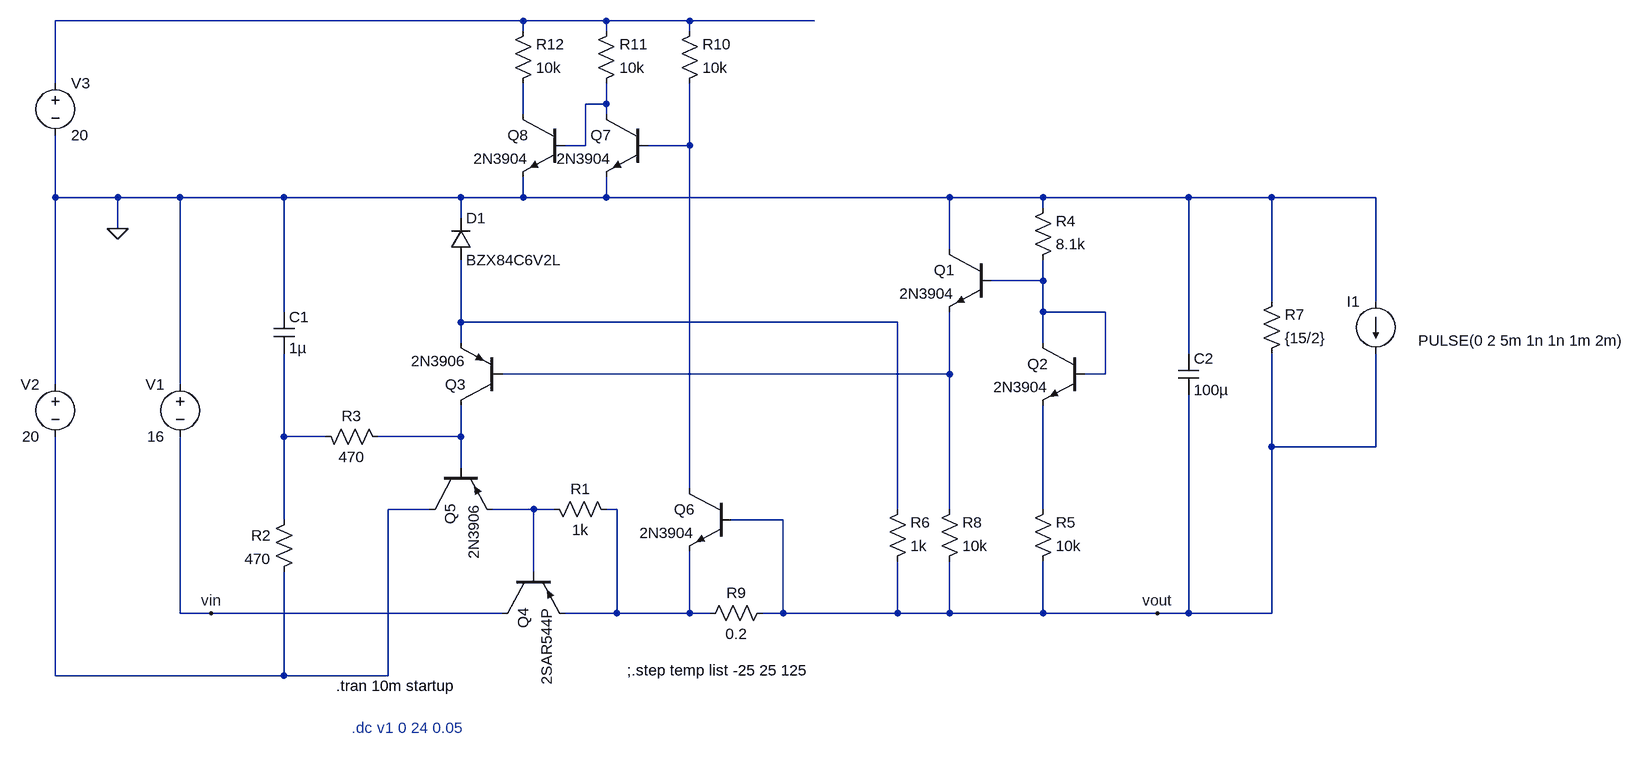
[diagram p0: schematic linear_regulator_negative1.asc]
linear_regulator_negative1.asc, the LTspice schematic file:
Version 4.1
SHEET 1 2004 928
WIRE 304 -176 -416 -176
WIRE 432 -176 304 -176
WIRE 560 -176 432 -176
WIRE 752 -176 560 -176
WIRE 304 -160 304 -176
WIRE 432 -160 432 -176
WIRE 560 -160 560 -176
WIRE -416 -80 -416 -176
WIRE 432 -48 432 -80
WIRE 432 -48 400 -48
WIRE 304 -32 304 -80
WIRE 432 -32 432 -48
WIRE 400 16 400 -48
WIRE 400 16 368 16
WIRE 560 16 560 -80
WIRE 560 16 496 16
WIRE -416 96 -416 0
WIRE -320 96 -416 96
WIRE -224 96 -320 96
WIRE -64 96 -224 96
WIRE 208 96 -64 96
WIRE 304 96 304 64
WIRE 304 96 208 96
WIRE 432 96 432 64
WIRE 432 96 304 96
WIRE 960 96 432 96
WIRE 1104 96 960 96
WIRE 1328 96 1104 96
WIRE 1456 96 1328 96
WIRE 1616 96 1456 96
WIRE 1104 112 1104 96
WIRE 208 128 208 96
WIRE -320 144 -320 96
WIRE 960 176 960 96
WIRE 1104 224 1104 192
WIRE 1104 224 1024 224
WIRE 1456 256 1456 96
WIRE 1616 256 1616 96
WIRE -64 272 -64 96
WIRE 1104 272 1104 224
WIRE 1200 272 1104 272
WIRE 208 288 208 192
WIRE 880 288 208 288
WIRE 208 320 208 288
WIRE 1104 320 1104 272
WIRE 1328 336 1328 96
WIRE 960 368 960 272
WIRE 960 368 272 368
WIRE 1200 368 1200 272
WIRE 1200 368 1168 368
WIRE -416 384 -416 96
WIRE -224 384 -224 96
WIRE -64 464 -64 336
WIRE 0 464 -64 464
WIRE 208 464 208 416
WIRE 208 464 80 464
WIRE 1456 480 1456 336
WIRE 1616 480 1616 336
WIRE 1616 480 1456 480
WIRE 208 512 208 464
WIRE 560 544 560 16
WIRE 160 576 96 576
WIRE 320 576 256 576
WIRE 352 576 320 576
WIRE 448 576 432 576
WIRE 880 576 880 288
WIRE 960 576 960 368
WIRE 1104 576 1104 416
WIRE -64 592 -64 464
WIRE 704 592 624 592
WIRE 320 672 320 576
WIRE -224 736 -224 464
WIRE -176 736 -224 736
WIRE 272 736 -176 736
WIRE 448 736 448 576
WIRE 448 736 368 736
WIRE 560 736 560 640
WIRE 560 736 448 736
WIRE 592 736 560 736
WIRE 704 736 704 592
WIRE 704 736 672 736
WIRE 880 736 880 656
WIRE 880 736 704 736
WIRE 960 736 960 656
WIRE 960 736 880 736
WIRE 1104 736 1104 656
WIRE 1104 736 960 736
WIRE 1280 736 1104 736
WIRE 1328 736 1328 400
WIRE 1328 736 1280 736
WIRE 1456 736 1456 480
WIRE 1456 736 1328 736
WIRE -416 832 -416 464
WIRE -64 832 -64 672
WIRE -64 832 -416 832
WIRE 96 832 96 576
WIRE 96 832 -64 832
FLAG -320 144 0
FLAG -176 736 vin
FLAG 1280 736 vout
SYMBOL npn 1024 176 M0
SYMATTR InstName Q1
SYMATTR Value 2N3904
SYMBOL npn 1168 320 M0
SYMATTR InstName Q2
SYMATTR Value 2N3904
SYMBOL res 448 592 M270
WINDOW 0 32 56 VTop 2
WINDOW 3 0 56 VBottom 2
SYMATTR InstName R1
SYMATTR Value 1k
SYMBOL res -48 576 M0
SYMATTR InstName R2
SYMATTR Value 470
SYMBOL res -16 448 M90
WINDOW 0 0 56 VBottom 2
WINDOW 3 32 56 VTop 2
SYMATTR InstName R3
SYMATTR Value 470
SYMBOL res 1088 208 M180
WINDOW 0 36 76 Left 2
WINDOW 3 36 40 Left 2
SYMATTR InstName R4
SYMATTR Value 8.1k
SYMBOL res 1088 672 M180
WINDOW 0 36 76 Left 2
WINDOW 3 36 40 Left 2
SYMATTR InstName R5
SYMATTR Value 10k
SYMBOL res 864 672 M180
WINDOW 0 36 76 Left 2
WINDOW 3 36 40 Left 2
SYMATTR InstName R6
SYMATTR Value 1k
SYMBOL diode 192 192 M180
WINDOW 0 24 64 Left 2
WINDOW 3 24 0 Left 2
SYMATTR InstName D1
SYMATTR Value BZX84C6V2L
SYMBOL cap -80 336 M180
WINDOW 0 24 56 Left 2
WINDOW 3 24 8 Left 2
SYMATTR InstName C1
SYMATTR Value 1µ
SYMBOL cap 1312 400 M180
WINDOW 0 24 56 Left 2
WINDOW 3 24 8 Left 2
SYMATTR InstName C2
SYMATTR Value 100µ
SYMBOL voltage -224 368 M0
SYMATTR InstName V1
SYMATTR Value 16
SYMBOL res 1440 352 M180
WINDOW 0 36 76 Left 2
WINDOW 3 36 40 Left 2
SYMATTR InstName R7
SYMATTR Value {15/2}
SYMBOL pnp 272 672 M90
SYMATTR InstName Q4
SYMATTR Value 2SAR544P
SYMBOL res 944 672 M180
WINDOW 0 36 76 Left 2
WINDOW 3 36 40 Left 2
SYMATTR InstName R8
SYMATTR Value 10k
SYMBOL pnp 160 512 M90
SYMATTR InstName Q5
SYMATTR Value 2N3906
SYMBOL current 1616 256 M0
WINDOW 123 0 0 Left 0
WINDOW 39 0 0 Left 0
WINDOW 3 -383 60 Left 2
SYMATTR InstName I1
SYMATTR Value PULSE(0 2 5m 1n 1n 1m 2m)
SYMBOL voltage -416 368 M0
WINDOW 123 0 0 Left 0
WINDOW 39 0 0 Left 0
SYMATTR InstName V2
SYMATTR Value 20
SYMBOL pnp 272 416 R180
SYMATTR InstName Q3
SYMATTR Value 2N3906
SYMBOL res 688 720 R90
WINDOW 0 0 56 VBottom 2
WINDOW 3 32 56 VTop 2
SYMATTR InstName R9
SYMATTR Value 0.2
SYMBOL npn 624 544 M0
SYMATTR InstName Q6
SYMATTR Value 2N3904
SYMBOL res 544 -64 M180
WINDOW 0 36 76 Left 2
WINDOW 3 36 40 Left 2
SYMATTR InstName R10
SYMATTR Value 10k
SYMBOL voltage -416 -96 R0
WINDOW 123 0 0 Left 0
WINDOW 39 0 0 Left 0
SYMATTR InstName V3
SYMATTR Value 20
SYMBOL res 416 -64 M180
WINDOW 0 36 76 Left 2
WINDOW 3 36 40 Left 2
SYMATTR InstName R11
SYMATTR Value 10k
SYMBOL npn 496 -32 M0
SYMATTR InstName Q7
SYMATTR Value 2N3904
SYMBOL res 288 -64 M180
WINDOW 0 36 76 Left 2
WINDOW 3 36 40 Left 2
SYMATTR InstName R12
SYMATTR Value 10k
SYMBOL npn 368 -32 M0
SYMATTR InstName Q8
SYMATTR Value 2N3904
TEXT 16 848 Left 2 !.tran 10m startup
TEXT 464 824 Left 2 !;.step temp list -25 25 125
TEXT 40 912 Left 2 ;.dc v1 0 24 0.05

The netlist it stands for:
* linear_regulator_negative1.asc
Q1 0 N005 N007 0 2N3904
Q2 N005 N005 N013 0 2N3904
R1 N012 N011 1k
R2 N008 N010 470
R3 N008 N009 470
R4 N005 0 8.1k
R5 vout N013 10k
R6 vout N006 1k
D1 N006 0 BZX84C6V2L
C1 N008 0 1µ
C2 vout 0 100µ
V1 0 vin 16
R7 vout 0 {15/2}
Q4 vin N011 N012 0 2SAR544P
R8 vout N007 10k
Q5 N010 N009 N011 0 2N3906
I1 0 vout PULSE(0 2 5m 1n 1n 1m 2m)
V2 0 N010 20
Q3 N009 N007 N006 0 2N3906
R9 vout N012 0.2
Q6 N004 vout N012 0 2N3904
R10 N004 N001 10k
V3 N001 0 20
R11 N002 N001 10k
Q7 N002 N004 0 0 2N3904
R12 N003 N001 10k
Q8 N003 N002 0 0 2N3904
.model D D
.lib standard.dio
.model NPN NPN
.model PNP PNP
.lib standard.bjt
.tran 10m startup
;.step temp list -25 25 125
* .dc v1 0 24 0.05
.backanno
.end